# Altium schematic sheet MCU_pinout.SchDoc
size A4; SheetNumber: 1; SheetTotal: 3
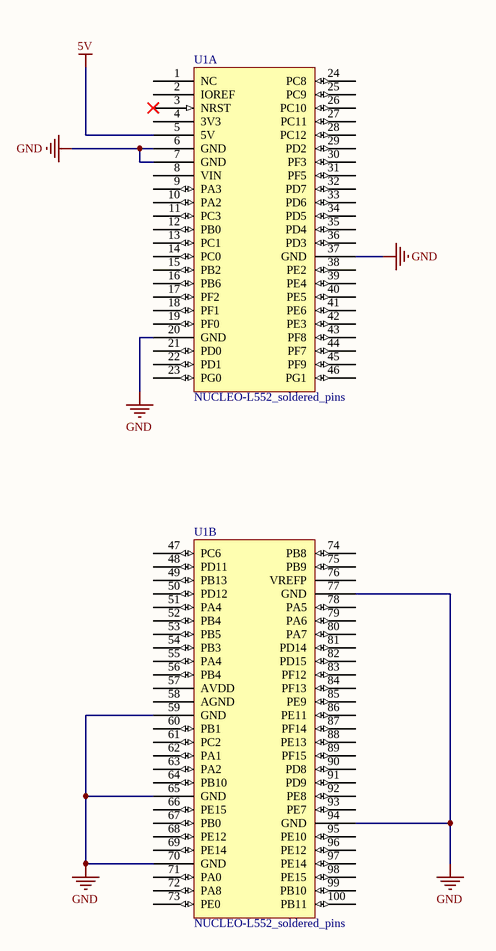
[diagram p0: MCU_pinout.SchDoc]

## Parts
U1  NUCLEO-L552_soldered_pins  [FP_NUCLEO-144 inner connector]  (parts A,B of 2)

## Nets
5V: U1.5(5V)
GND: U1.6(GND) U1.7(GND) U1.20(GND) U1.37(GND) U1.59(GND) U1.65(GND) U1.70(GND) U1.77(GND) U1.94(GND)

Not connected (* = marked no-connect by the designer): U1 1(NC) 2(IOREF) 3(NRST)* 4(3V3) 8(VIN) 9(PA3) 10(PA2) 11(PC3) 12(PB0) 13(PC1) 14(PC0) 15(PB2) 16(PB6) 17(PF2) 18(PF1) 19(PF0) 21(PD0) 22(PD1) 23(PG0) 24(PC8) 25(PC9) 26(PC10) 27(PC11) 28(PC12) 29(PD2) 30(PF3) 31(PF5) 32(PD7) 33(PD6) 34(PD5) 35(PD4) 36(PD3) 38(PE2) 39(PE4) 40(PE5) 41(PE6) 42(PE3) 43(PF8) 44(PF7) 45(PF9) 46(PG1) 47(PC6) 48(PD11) 49(PB13) 50(PD12) 51(PA4) 52(PB4) 53(PB5) 54(PB3) 55(PA4) 56(PB4) 57(AVDD) 58(AGND) 60(PB1) 61(PC2) 62(PA1) 63(PA2) 64(PB10) 66(PE15) 67(PB0) 68(PE12) 69(PE14) 71(PA0) 72(PA8) 73(PE0) 74(PB8) 75(PB9) 76(VREFP) 78(PA5) 79(PA6) 80(PA7) 81(PD14) 82(PD15) 83(PF12) 84(PF13) 85(PE9) 86(PE11) 87(PF14) 88(PE13) 89(PF15) 90(PD8) 91(PD9) 92(PE8) 93(PE7) 95(PE10) 96(PE12) 97(PE14) 98(PE15) 99(PB10) 100(PB11)

## Library data of the parts
U1 = NUCLEO-L552_inner: https://www.st.com/resource/en/user_manual/um2581-stm32l5-nucleo144-board-mb1361-stmicroelectronics.pdf